# Altium schematic sheet TOC.SchDoc
size A4
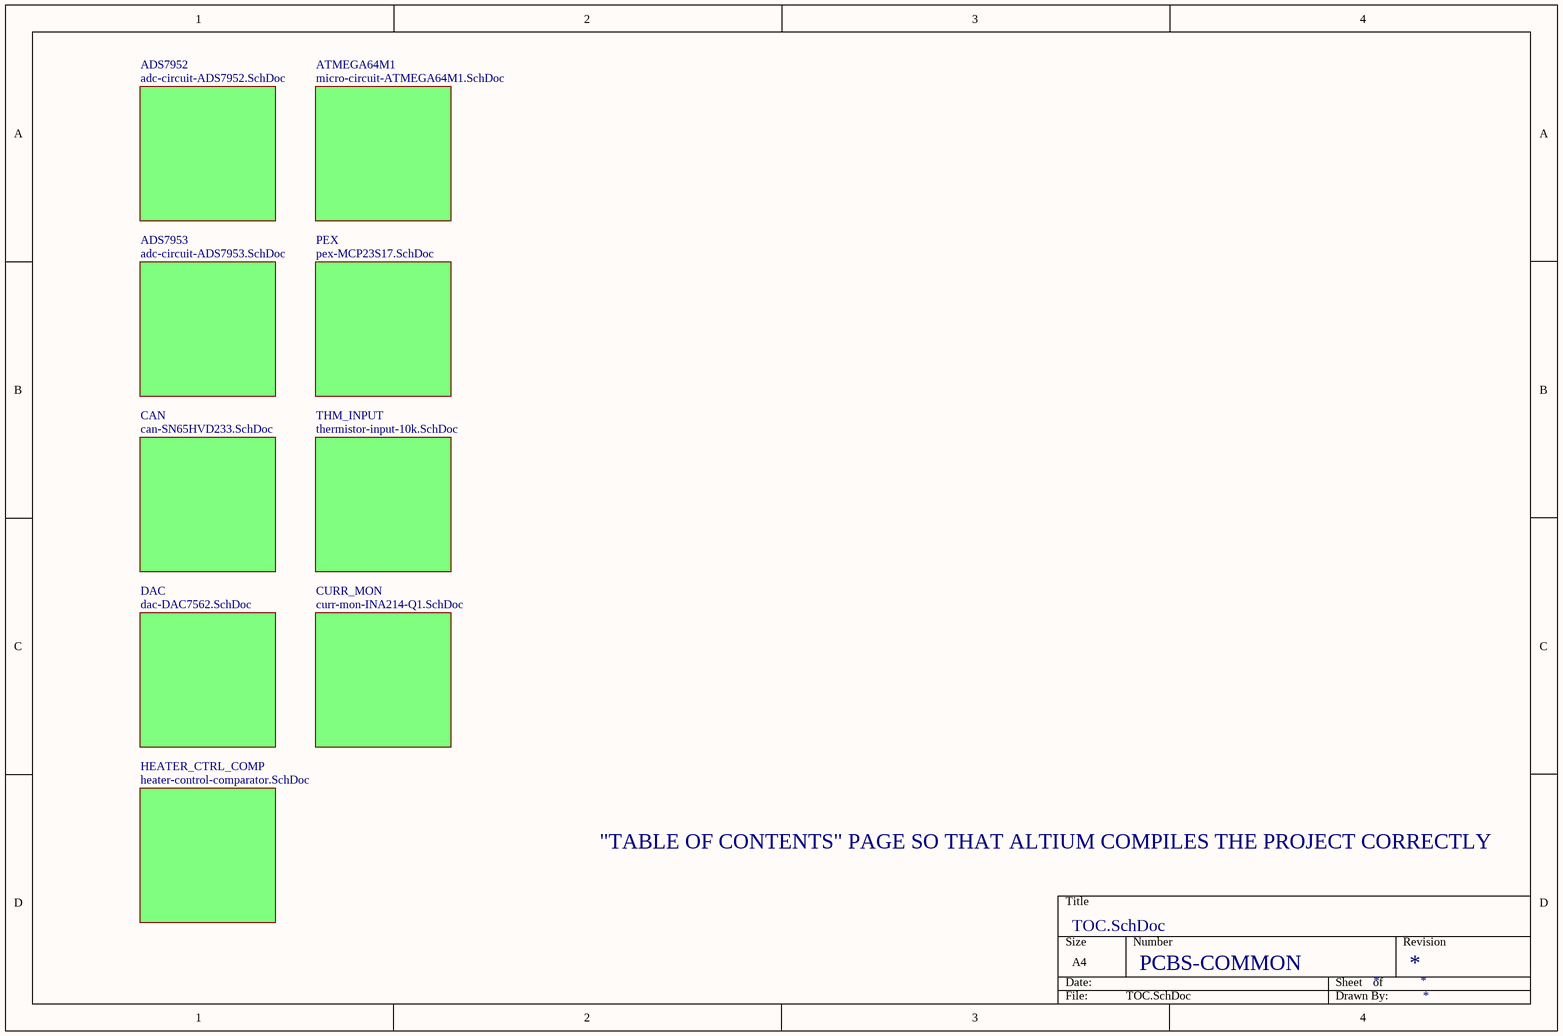
[diagram p0: TOC.SchDoc]

## Sub-sheets
ADS7952 = adc-circuit-ADS7952.SchDoc: no entries
ADS7953 = adc-circuit-ADS7953.SchDoc: no entries
ATMEGA64M1 = micro-circuit-ATMEGA64M1.SchDoc: no entries
CAN = can-SN65HVD233.SchDoc: no entries
CURR_MON = curr-mon-INA214-Q1.SchDoc: no entries
DAC = dac-DAC7562.SchDoc: no entries
HEATER_CTRL_COMP = heater-control-comparator.SchDoc: no entries
PEX = pex-MCP23S17.SchDoc: no entries
THM_INPUT = thermistor-input-10k.SchDoc: no entries

## Notes on the sheet
- "TABLE OF CONTENTS" PAGE SO THAT ALTIUM COMPILES THE PROJECT CORRECTLY
- PCBS-COMMON